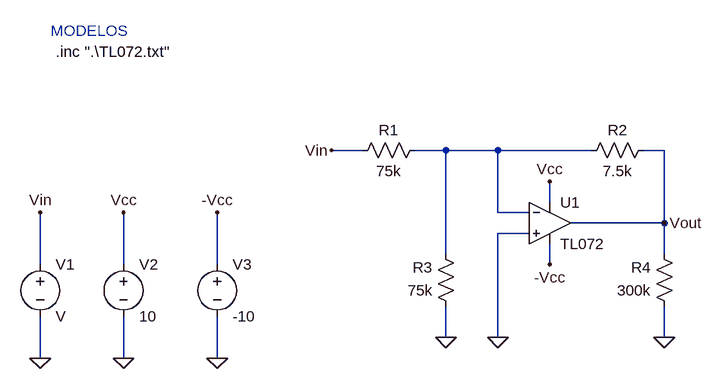
[diagram p0: schematic Modelo-1.asc]
Modelo-1.asc, the LTspice schematic file:
Version 4
SHEET 1 1860 680
WIRE 208 -144 160 -144
WIRE 336 -144 288 -144
WIRE 416 -144 336 -144
WIRE 560 -144 416 -144
WIRE 672 -144 640 -144
WIRE 496 -64 496 -96
WIRE 416 -48 416 -144
WIRE 464 -48 416 -48
WIRE 672 -32 672 -144
WIRE 672 -32 528 -32
WIRE 464 -16 416 -16
WIRE 336 16 336 -144
WIRE 672 16 672 -32
WIRE -288 32 -288 -48
WIRE -160 32 -160 -48
WIRE -16 32 -16 -48
WIRE 496 32 496 0
WIRE 336 144 336 96
WIRE 416 144 416 -16
WIRE 672 144 672 96
WIRE -288 176 -288 112
WIRE -160 176 -160 112
WIRE -16 176 -16 112
FLAG 336 144 0
FLAG 672 144 0
FLAG 416 144 0
FLAG -288 176 0
FLAG -160 176 0
FLAG -16 176 0
FLAG -160 -48 Vcc
FLAG 496 -96 Vcc
FLAG -16 -48 -Vcc
FLAG 496 32 -Vcc
FLAG -288 -48 Vin
FLAG 160 -144 Vin
FLAG 672 -32 Vout
SYMBOL res 304 -160 R90
WINDOW 0 0 56 VBottom 2
WINDOW 3 32 56 VTop 2
SYMATTR InstName R1
SYMATTR Value 75k
SYMBOL res 656 -160 R90
WINDOW 0 0 56 VBottom 2
WINDOW 3 32 56 VTop 2
SYMATTR InstName R2
SYMATTR Value 7.5k
SYMBOL res 352 112 R180
WINDOW 0 36 76 Left 2
WINDOW 3 36 40 Left 2
SYMATTR InstName R3
SYMATTR Value 75k
SYMBOL res 688 112 R180
WINDOW 0 36 76 Left 2
WINDOW 3 36 40 Left 2
SYMATTR InstName R4
SYMATTR Value 300k
SYMBOL Opamps\\opamp2 496 -96 R0
SYMATTR InstName U1
SYMATTR Value TL072
SYMBOL voltage -288 16 R0
SYMATTR InstName V1
SYMBOL voltage -160 16 R0
SYMATTR InstName V2
SYMATTR Value 10
SYMBOL voltage -16 16 R0
SYMATTR InstName V3
SYMATTR Value -10
TEXT -264 -296 Left 2 !.inc ".\\TL072.txt"
TEXT -272 -328 Left 2 ;MODELOS

The netlist it stands for:
* Modelo-1.asc
R1 N001 Vin 75k
R2 Vout N001 7.5k
R3 0 N001 75k
R4 0 Vout 300k
XU1 0 N001 Vcc -Vcc Vout TL072  ; pins In+ In- V+ V- OUT
V1 Vin 0 V
V2 Vcc 0 10
V3 -Vcc 0 -10
.inc ".\TL072.txt"
* MODELOS
.backanno
.end